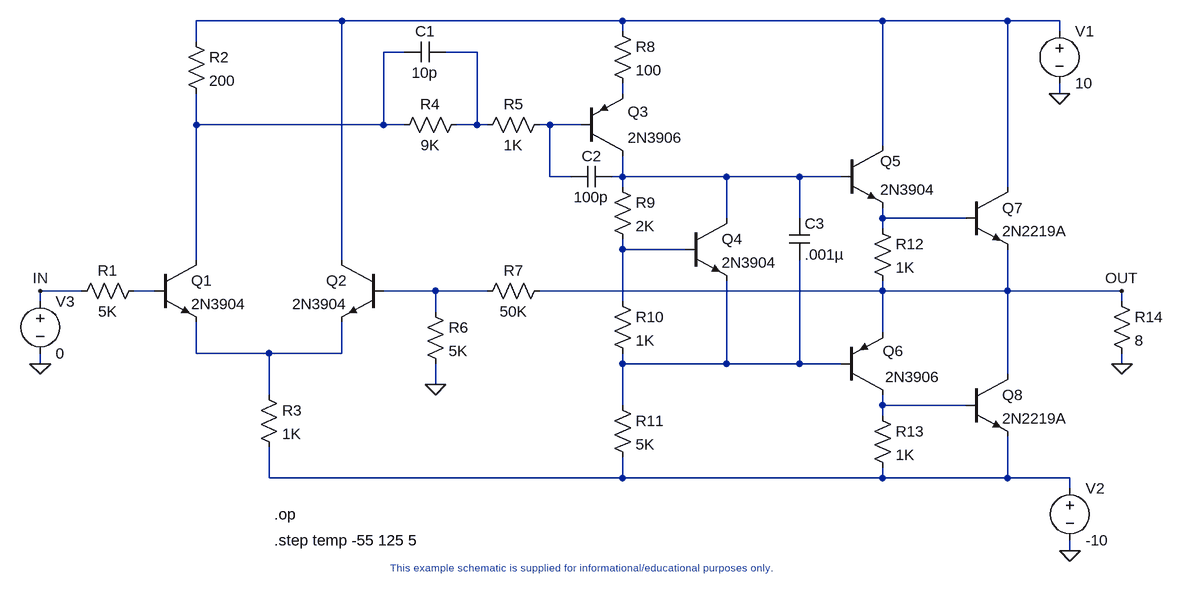
[diagram p0: schematic steptemp.asc]
steptemp.asc, the LTspice schematic file:
Version 4
SHEET 1 2404 1864
WIRE 1024 944 800 944
WIRE 1456 944 1024 944
WIRE 1856 944 1456 944
WIRE 2048 944 1856 944
WIRE 2128 944 2048 944
WIRE 1456 960 1456 944
WIRE 2128 960 2128 944
WIRE 800 976 800 944
WIRE 1120 992 1088 992
WIRE 1232 992 1184 992
WIRE 1456 1056 1456 1040
WIRE 2128 1056 2128 1040
WIRE 800 1104 800 1056
WIRE 1088 1104 1088 992
WIRE 1088 1104 800 1104
WIRE 1120 1104 1088 1104
WIRE 1232 1104 1232 992
WIRE 1232 1104 1200 1104
WIRE 1248 1104 1232 1104
WIRE 1344 1104 1328 1104
WIRE 1392 1104 1344 1104
WIRE 1856 1136 1856 944
WIRE 1344 1184 1344 1104
WIRE 1376 1184 1344 1184
WIRE 1456 1184 1456 1152
WIRE 1456 1184 1440 1184
WIRE 1616 1184 1456 1184
WIRE 1728 1184 1616 1184
WIRE 1792 1184 1728 1184
WIRE 1456 1200 1456 1184
WIRE 2048 1200 2048 944
WIRE 1616 1248 1616 1184
WIRE 1728 1248 1728 1184
WIRE 1856 1248 1856 1232
WIRE 1984 1248 1856 1248
WIRE 1856 1264 1856 1248
WIRE 1456 1296 1456 1280
WIRE 1552 1296 1456 1296
WIRE 800 1312 800 1104
WIRE 1024 1312 1024 944
WIRE 624 1360 560 1360
WIRE 736 1360 704 1360
WIRE 1168 1360 1088 1360
WIRE 1248 1360 1168 1360
WIRE 1856 1360 1856 1344
WIRE 1856 1360 1328 1360
WIRE 2048 1360 2048 1296
WIRE 2048 1360 1856 1360
WIRE 2224 1360 2048 1360
WIRE 560 1376 560 1360
WIRE 1456 1376 1456 1296
WIRE 2224 1376 2224 1360
WIRE 1168 1392 1168 1360
WIRE 1856 1424 1856 1360
WIRE 800 1456 800 1408
WIRE 912 1456 800 1456
WIRE 1024 1456 1024 1408
WIRE 1024 1456 912 1456
WIRE 560 1472 560 1456
WIRE 1456 1472 1456 1456
WIRE 1616 1472 1616 1344
WIRE 1616 1472 1456 1472
WIRE 1728 1472 1728 1312
WIRE 1728 1472 1616 1472
WIRE 1792 1472 1728 1472
WIRE 2224 1472 2224 1456
WIRE 2048 1488 2048 1360
WIRE 1168 1504 1168 1472
WIRE 912 1520 912 1456
WIRE 1456 1536 1456 1472
WIRE 1856 1536 1856 1520
WIRE 1984 1536 1856 1536
WIRE 1856 1552 1856 1536
WIRE 912 1648 912 1600
WIRE 1456 1648 1456 1616
WIRE 1456 1648 912 1648
WIRE 1856 1648 1856 1632
WIRE 1856 1648 1456 1648
WIRE 2048 1648 2048 1584
WIRE 2048 1648 1856 1648
WIRE 2144 1648 2048 1648
WIRE 2144 1664 2144 1648
WIRE 2144 1760 2144 1744
FLAG 2128 1056 0
FLAG 2144 1760 0
FLAG 2224 1472 0
FLAG 1168 1504 0
FLAG 560 1472 0
FLAG 560 1360 IN
FLAG 2224 1360 OUT
SYMBOL NPN 1792 1136 R0
WINDOW 0 60 24 Left 2
WINDOW 3 60 68 Left 2
SYMATTR InstName Q5
SYMATTR Value 2N3904
SYMBOL npn 1984 1200 R0
SYMATTR InstName Q7
SYMATTR Value 2N2219A
SYMBOL npn 1984 1488 R0
SYMATTR InstName Q8
SYMATTR Value 2N2219A
SYMBOL PNP 1792 1520 M180
WINDOW 0 64 68 Left 2
WINDOW 3 68 28 Left 2
SYMATTR InstName Q6
SYMATTR Value 2N3906
SYMBOL VOLTAGE 2128 944 R0
SYMATTR InstName V1
SYMATTR Value 10
SYMBOL voltage 2144 1648 R0
SYMATTR InstName V2
SYMATTR Value -10
SYMBOL RES 1440 1520 R0
SYMATTR InstName R11
SYMATTR Value 5K
SYMBOL res 2208 1360 R0
SYMATTR InstName R14
SYMATTR Value 8
SYMBOL res 1440 1184 R0
SYMATTR InstName R9
SYMATTR Value 2K
SYMBOL res 1440 1360 R0
SYMATTR InstName R10
SYMATTR Value 1K
SYMBOL npn 1552 1248 R0
SYMATTR InstName Q4
SYMATTR Value 2N3904
SYMBOL npn 736 1312 R0
SYMATTR InstName Q1
SYMATTR Value 2N3904
SYMBOL npn 1088 1312 M0
SYMATTR InstName Q2
SYMATTR Value 2N3904
SYMBOL res 784 960 R0
SYMATTR InstName R2
SYMATTR Value 200
SYMBOL res 896 1504 R0
SYMATTR InstName R3
SYMATTR Value 1K
SYMBOL pnp 1392 1152 M180
WINDOW 0 72 68 Left 2
WINDOW 3 72 28 Left 2
SYMATTR InstName Q3
SYMATTR Value 2N3906
SYMBOL res 1152 1376 R0
SYMATTR InstName R6
SYMATTR Value 5K
SYMBOL res 1344 1344 R90
WINDOW 0 0 56 VBottom 2
WINDOW 3 32 56 VTop 2
SYMATTR InstName R7
SYMATTR Value 50K
SYMBOL voltage 560 1360 R0
SYMATTR InstName V3
SYMATTR Value 0
SYMBOL res 720 1344 R90
WINDOW 0 0 56 VBottom 2
WINDOW 3 32 56 VTop 2
SYMATTR InstName R1
SYMATTR Value 5K
SYMBOL res 1440 944 R0
SYMATTR InstName R8
SYMATTR Value 100
SYMBOL res 1216 1088 R90
WINDOW 0 0 56 VBottom 2
WINDOW 3 32 56 VTop 2
SYMATTR InstName R4
SYMATTR Value 9K
SYMBOL cap 1440 1168 R90
WINDOW 0 0 32 VBottom 2
WINDOW 3 32 32 VTop 2
SYMATTR InstName C2
SYMATTR Value 100p
SYMBOL cap 1184 976 R90
WINDOW 0 0 32 VBottom 2
WINDOW 3 32 32 VTop 2
SYMATTR InstName C1
SYMATTR Value 10p
SYMBOL res 1840 1536 R0
SYMATTR InstName R13
SYMATTR Value 1K
SYMBOL res 1840 1248 R0
SYMATTR InstName R12
SYMATTR Value 1K
SYMBOL cap 1712 1248 R0
SYMATTR InstName C3
SYMATTR Value .001µ
SYMBOL res 1344 1088 R90
WINDOW 0 0 56 VBottom 2
WINDOW 3 32 56 VTop 2
SYMATTR InstName R5
SYMATTR Value 1K
TEXT 920 1704 Left 2 !.op
TEXT 1384 1776 Top 1 ;This example schematic is supplied for informational/educational purposes only.
TEXT 920 1744 Left 2 !.step temp -55 125 5

The netlist it stands for:
* steptemp.asc
Q5 N001 N006 N007 0 2N3904
Q7 N001 N007 OUT 0 2N2219A
Q8 OUT N013 N014 0 2N2219A
Q6 N013 N012 OUT 0 2N3906
V1 N001 0 10
V2 N014 0 -10
R11 N012 N014 5K
R14 OUT 0 8
R9 N006 N008 2K
R10 N008 N012 1K
Q4 N006 N008 N012 0 2N3904
Q1 N002 N009 N011 0 2N3904
Q2 N001 N010 N011 0 2N3904
R2 N001 N002 200
R3 N011 N014 1K
Q3 N006 N005 N004 0 2N3906
R6 N010 0 5K
R7 OUT N010 50K
V3 IN 0 0
R1 N009 IN 5K
R8 N001 N004 100
R4 N003 N002 9K
C2 N006 N005 100p
C1 N003 N002 10p
R13 N013 N014 1K
R12 N007 OUT 1K
C3 N006 N012 .001µ
R5 N005 N003 1K
.model NPN NPN
.model PNP PNP
.lib standard.bjt
.op
* This example schematic is supplied for informational/educational purposes only.
.step temp -55 125 5
.backanno
.end